# EAGLE design w5-MIDI_v03(rev4_4) (EAGLE 6.6.0)
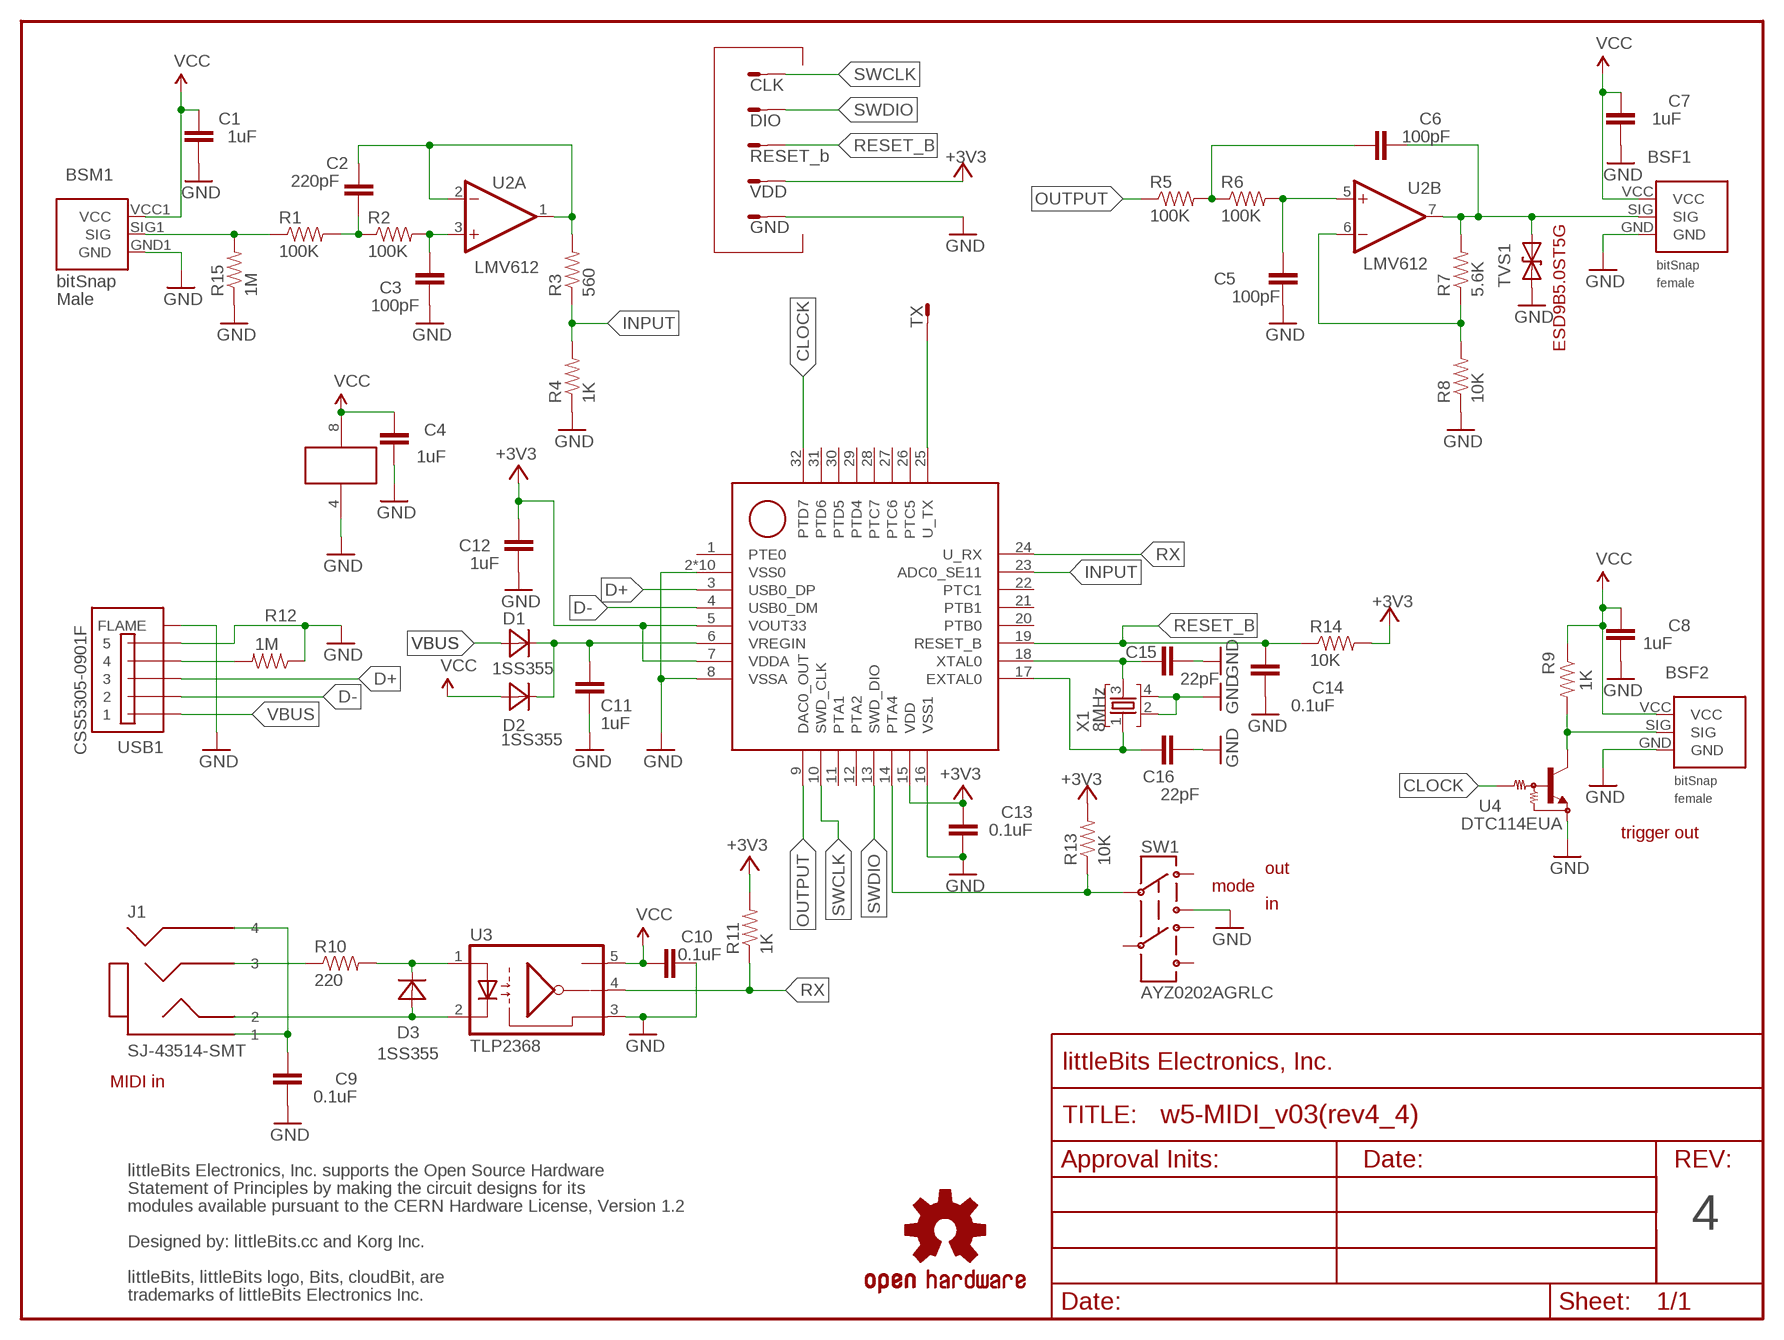
[diagram p0: schematic, sheet 1]

## Parts
BSF1  BITSNAP_V03_FEMALE  [BITSNAP_V03_FEMALE]
BSF2  BITSNAP_V03_FEMALE  [BITSNAP_V03_FEMALE]
BSM1  BITSNAP_V03_MALE  [BITSNAP_V03_MALE]
C1  1uF  CC_1608_0.8_TBR_LB_1  [CC_1608_0.8_TBR_LB_1PRIMARY]
C2  220pF  CC_1608_0.8_TBR_LB_1  [CC_1608_0.8_TBR_LB_1PRIMARY]
C3  100pF  CC_1608_0.8_TBR_LB_1  [CC_1608_0.8_TBR_LB_1PRIMARY]
C4  1uF  CC_1608_0.8_TBR_LB_1  [CC_1608_0.8_TBR_LB_1PRIMARY]
C5  100pF  CC_1608_0.8_TBR_LB_1  [CC_1608_0.8_TBR_LB_1PRIMARY]
C6  100pF  CC_1608_0.8_TBR_LB_1  [CC_1608_0.8_TBR_LB_1PRIMARY]
C7  1uF  CC_1608_0.8_TBR_LB_1  [CC_1608_0.8_TBR_LB_1PRIMARY]
C8  1uF  CC_1608_0.8_TBR_LB_1  [CC_1608_0.8_TBR_LB_1PRIMARY]
C9  0.1uF  CC_1608_0.8_TBR_LB_1  [CC_1608_0.8_TBR_LB_1PRIMARY]
C10  0.1uF  CC_1608_0.8_TBR_LB_1  [CC_1608_0.8_TBR_LB_1PRIMARY]
C11  1uF  CC_1608_0.8_TBR_LB_1  [CC_1608_0.8_TBR_LB_1PRIMARY]
C12  1uF  CC_1608_0.8_TBR_LB_1  [CC_1608_0.8_TBR_LB_1PRIMARY]
C13  0.1uF  CC_1608_0.8_TBR_LB_1  [CC_1608_0.8_TBR_LB_1PRIMARY]
C14  0.1uF  CC_1608_0.8_TBR_LB_1  [CC_1608_0.8_TBR_LB_1PRIMARY]
C15  22pF  CC_1608_0.8_TBR_LB_1  [CC_1608_0.8_TBR_LB_1PRIMARY]
C16  22pF  CC_1608_0.8_TBR_LB_1  [CC_1608_0.8_TBR_LB_1PRIMARY]
D1  1SS355  DISC_ROHM-UMD2_#_TBR_LB_1  [DISC_ROHM-UMD2_#_TBR_LB_1PRIMARY]
D2  1SS355  DISC_ROHM-UMD2_#_TBR_LB_1  [DISC_ROHM-UMD2_#_TBR_LB_1PRIMARY]
D3  1SS355  DISC_ROHM-UMD2_#_TBR_LB_1  [DISC_ROHM-UMD2_#_TBR_LB_1PRIMARY]
FRAME1  FRAME-LETTER-OHWOHW  [FABDWG01-OHW]
J1  SJ-43514-SMT  LB_K_CN_SJ-43514-SMT_LB  [LB_K_CN_SJ-43514-SMT_LB]
R1  100K  R_1608_LB  [R_1608_LB]
R2  100K  R_1608_LB  [R_1608_LB]
R3  560  R_1608_LB  [R_1608_LB]
R4  1K  R_1608_LB  [R_1608_LB]
R5  100K  R_1608_LB  [R_1608_LB]
R6  100K  R_1608_LB  [R_1608_LB]
R7  5.6K  R_1608_LB  [R_1608_LB]
R8  10K  R_1608_LB  [R_1608_LB]
R9  1K  R_1608_LB  [R_1608_LB]
R10  220  R_1608_LB  [R_1608_LB]
R11  1K  R_1608_LB  [R_1608_LB]
R12  1M  R_1608_LB  [R_1608_LB]
R13  10K  R_1608_LB  [R_1608_LB]
R14  10K  R_1608_LB  [R_1608_LB]
R15  1M  RESISTOR0402  [RES-0402]
SW1  AYZ0202AGRLC  SW_MS-22C01_#_TBR_LB_1  [SW_MS-22C01_#_TBR_LB_1PRIMARY]
TVS1  DIODE-TVSSOD-923  [SOD-923]
U1  MKL26Z64VFM4  IC_TI-QFN32_0.5_TBR_LB_1  [IC_TI-QFN32_0.5_TBR_LB_1PRIMARY]
U2  LMV612  IC_TSSOP8-DCK_0.65_TBR_LB_1  [IC_TSSOP8-DCK_0.65_TBR_LB_1PRIMARY]
U3  TLP2368  PC_PS9117-F3-A_#_TBR_LB_1  [PC_PS9117-F3-A_#_TBR_LB_1PRIMARY]
U4  DTC114EUA  DISC_SC-70_#_TBR_LB_1  [DISC_SC-70_#_TBR_LB_1PRIMARY]
U$1  OSHWCREDIT-KORG  [OSHWCREDIT-KORG]
U$5  OSHW-LOGOL  [OSHW-LOGO-L]
USB1  CSS5305-0901F  CSS5305-0109F  [MICRO-USB-FRONT-DIP-REAR-SMD]
W5JP1  GND  TEST_POINT_1  [TEST_POINT_1PRIMARY]
W5JP2  VDD  TEST_POINT_1  [TEST_POINT_1PRIMARY]
W5JP3  RESET_b  TEST_POINT_1  [TEST_POINT_1PRIMARY]
W5JP4  DIO  TEST_POINT_1  [TEST_POINT_1PRIMARY]
W5JP5  CLK  TEST_POINT_1  [TEST_POINT_1PRIMARY]
W5JP6  TX  TEST_POINT_1  [TEST_POINT_1PRIMARY]
X1  8MHz  X_ROSON_RT5_#_TBR_LB_1  [X_ROSON_RT5_#_TBR_LB_1PRIMARY]

## Nets
+3V3: C12.2 C13.2 R11.2 R13.2 R14.2 U1.5(VOUT33) U1.7(VDDA) U1.15(VDD) W5JP2.1(S)
CLOCK: U1.32(PTD7) U4.1(B)
D+: U1.3(USB0_DP) USB1.3
D-: U1.4(USB0_DM) USB1.2
GND: BSF1.GND BSF2.GND BSM1.GND1(GND) C1.2 C3.1 C4.1 C5.1 C7.1 C8.1 C9.1 C10.2 C11.2 C12.1 C13.1 C14.1 C15.1 C16.1 R4.1 R8.1 R12.1 R15.1 SW1.3 TVS1.1(A) U1.2(VSS0) U1.8(VSSA) U1.16(VSS1) U1.33(VSS0) U1.34(VSS0) U1.35(VSS0) U1.36(VSS0) U1.37(VSS0) U1.38(VSS0) U1.39(VSS0) U1.40(VSS0) U1.41(VSS0) U2.4(P:V-) U3.3(GND) U4.2(E) USB1.5 USB1.6(FLAME) USB1.7(FLAME) USB1.8(FLAME) USB1.9(FLAME) USB1.10(FLAME) USB1.11(FLAME) W5JP1.1(S) X1.2 X1.4
INPUT: R3.1 R4.2 U1.23(ADC0_SE11)
N$1: BSM1.SIG1(SIG) R1.1 R15.2
N$2: C2.2 R3.2 U2.1(A:OUT) U2.2(A:-IN)
N$3: C3.2 R2.2 U2.3(A:+IN)
N$4: C2.1 R1.2 R2.1
N$5: C9.2 J1.1 J1.4
N$6: BSF1.SIG C6.1 R7.2 TVS1.2(C) U2.7(B:OUT)
N$7: D3.1 J1.2 U3.2(C)
N$8: C11.1 D1.2 D2.2 U1.6(VREGIN)
N$9: C6.2 R5.2 R6.1
N$10: C5.2 R6.2 U2.5(B:+IN)
N$11: R13.1 SW1.2 U1.14(PTA4)
N$12: D3.2 R10.2 U3.1(A)
N$13: R12.2 USB1.4
N$15: C16.2 U1.17(EXTAL0) X1.1
N$16: C15.2 U1.18(XTAL0) X1.3
N$17: J1.3 R10.1
N$18: BSF2.SIG R9.2 U4.3(C)
N$20: R7.1 R8.2 U2.6(B:-IN)
OUTPUT: R5.1 U1.9(DAC0_OUT)
RESET_B: C14.2 R14.1 U1.19(RESET_B) W5JP3.1(S)
RX: R11.1 U1.24(U_RX) U3.4(VO)
SWCLK: U1.10(SWD_CLK) W5JP5.1(S)
SWDIO: U1.13(SWD_DIO) W5JP4.1(S)
TX: U1.25(U_TX) W5JP6.1(S)
VBUS: D1.1 USB1.1
VCC: BSF1.VCC BSF2.VCC BSM1.VCC1(VCC) C1.1 C4.2 C7.2 C8.2 C10.1 D2.1 R9.1 U2.8(P:V+) U3.5(VCC)
Unconnected: SW1.1 SW1.4 SW1.5 SW1.6 U1.1(PTE0) U1.11(PTA1) U1.12(PTA2) U1.20(PTB0) U1.21(PTB1) U1.22(PTC1) U1.26(PTC5) U1.27(PTC6) U1.28(PTC7) U1.29(PTD4) U1.30(PTD5) U1.31(PTD6)

## Notes on the sheet
- trigger out
- out
- mode
- in
- MIDI in
- 4

## Library data of the parts
BSF1 BSF2 = bitSnap:BITSNAP_V03_FEMALE
BSM1 = bitSnap:BITSNAP_V03_MALE
C1-C16 = LB_K:CC_1608_0.8_TBR_LB_1
D1-D3 = LB_K:DISC_ROHM-UMD2_#_TBR_LB_1
FRAME1 = LITTLEBITS:FRAME-LETTER-OHW
J1 = LITTLEBITS:LB_K_CN_SJ-43514-SMT_LB
R1-R14 = LB_K:R_1608_LB
R15 = LITTLEBITS:RESISTOR
SW1 = LB_K:SW_MS-22C01_#_TBR_LB_1
TVS1 = LITTLEBITS:DIODE-TVS: Bidirectional Transient Voltage Suppression Diode: Device conducts in avalanche mode after reaching a part dependent voltage threshold. Used for limiting voltage spikes on ESD sensitive inputs and outputs.; IEC_ESD_PROT0: +/-18kV; LB_PN: ?; MPN: ESD9B5.0ST5G; V_CLAMP: ?; V_OPERATION: 5V
U1 = LB_K:IC_TI-QFN32_0.5_TBR_LB_1
U2 = LB_K:IC_TSSOP8-DCK_0.65_TBR_LB_1
U3 = LB_K:PC_PS9117-F3-A_#_TBR_LB_1
U4 = LB_K:DISC_SC-70_#_TBR_LB_1
U$1 = LITTLEBITS:OSHWCREDIT-KORG
U$5 = LITTLEBITS:OSHW-LOGO: Open Source Hardware Logo This logo indicates the piece of hardware it is found on incorporates a OSHW license and/or adheres to the definition of open source hardware found here: http://freedomdefined.org/OSHW
USB1 = LITTLEBITS:CSS5305-0109F
W5JP1-W5JP6 = LB_K:TEST_POINT_1
X1 = LB_K:X_ROSON_RT5_#_TBR_LB_1

## Board
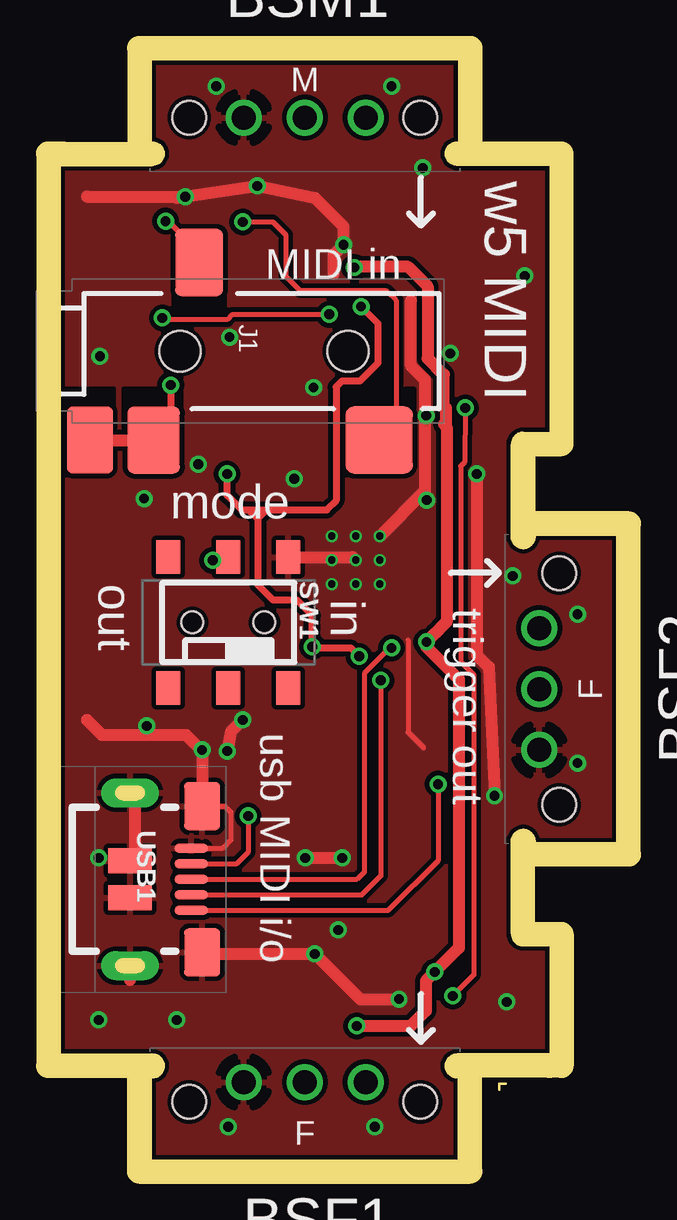
[diagram p1: board, top side]
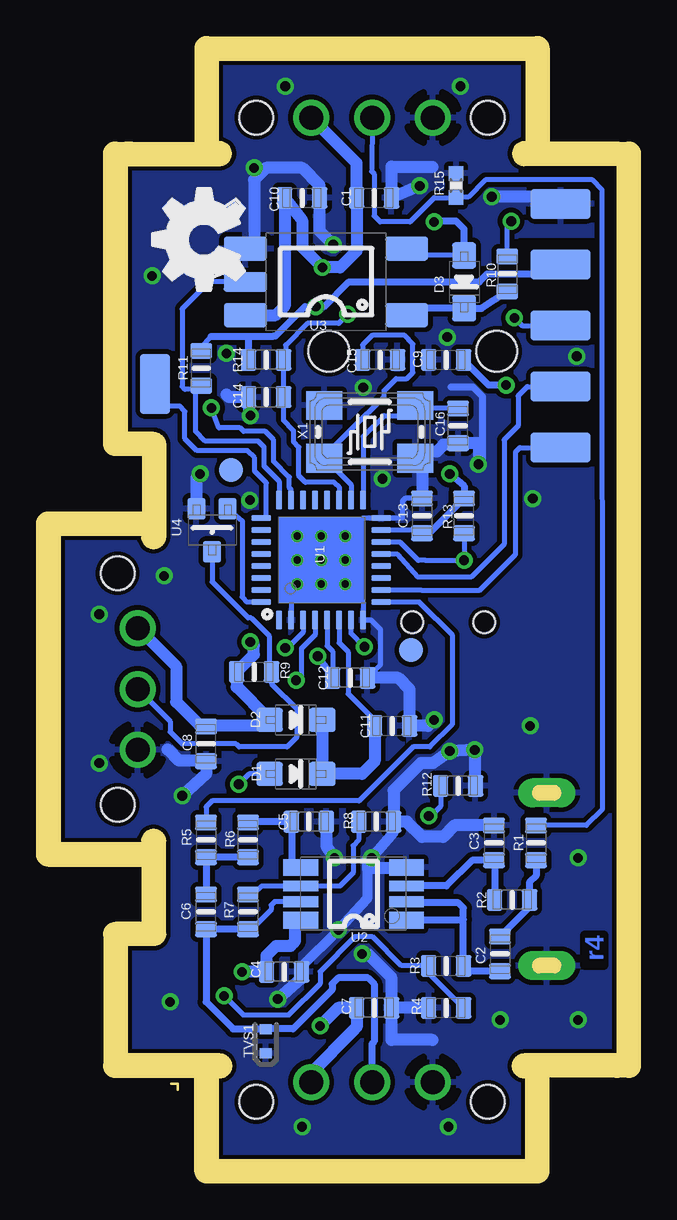
[diagram p2: board, bottom side, seen from below]

Size 23.2 x 45.81 mm. Coordinates in mm from the lower left corner, seen from the top.
Outline: 18.8,29.8 arc-90 19.3,30.3 20.4,30.3 20.4,41.41
Outline: 18.8,29.83 18.8,29.8
Outline: 3.8,0 3.8,3.4 3.85,3.4 arc180 3.85,4.4 0,4.4 0,41.41
Outline: 16.6,0 16.6,3.4 16.55,3.4 arc-180 16.55,4.4 20.4,4.4 20.4,8.9 19.3,8.9 arc-90 18.8,9.4 18.8,13.25 arc-180 19.8,13.25 19.8,13.2 23.2,13.2 23.2,26 19.8,26 19.8,25.95 arc-180 18.8,25.95 18.8,29.8
Copper layers (1*16): Top 0.035mm / dielectric 1.5mm / Bottom 0.035mm
Design rules "littleBitsDRC": minimum track width 0.2mm, minimum drill 0.2mm, track to track 0.2mm, track to pad 0.2mm, pad to pad 0.2mm, via to via 0.2mm, smd to smd 0mil, copper to edge 0.2mm, drill to drill 0.2mm, minimum pad ring 0.1mm, minimum via ring 0.15mm, stop-mask expansion 0.1mm, vias tented up to drill 0.5mm, thermal gap 0.2mm
bRestrict: 4 lines
Milling: 13 lines

### Footprints (pad centres in the part's own frame; a part is rotated, then mirrored left to right if it is on the bottom)
BITSNAP_V03_FEMALE = drill 1: GND 4.065,3.44; SIG 6.605,3.44; VCC 9.145,3.44 | hole 1.4: 1.785,2.61; 11.425,2.61
BITSNAP_V03_MALE = drill 1: GND1 9.145,2.61; SIG1 6.605,2.61; VCC1 4.065,2.61 | hole 1.4: 1.785,2.61; 11.425,2.61
CC_1608_0.8_TBR_LB_1PRIMARY = smd 0.65 x 0.9: 1 -0.725,0; 2 0.725,0
DISC_ROHM-UMD2_#_TBR_LB_1PRIMARY = smd 1.1 x 1: 1 -1.1,0; 2 1.1,0
LB_K_CN_SJ-43514-SMT_LB = smd 2.8 x 1.9: 1 -3.7,-0.75 | smd 2.8 x 2.8: 2 -3.7,-12.8 | smd 2.8 x 2: 3 3.7,-5.3 | smd 2.8 x 2.2: 4 -3.7,-3.4 | hole 1.7: 0,-4.5; 0,-11.5
R_1608_LB = smd 0.65 x 0.9: 1 -0.725,0; 2 0.725,0
RES-0402 = smd 0.6 x 0.6: 1 -0.5,0; 2 0.5,0
SW_MS-22C01_#_TBR_LB_1PRIMARY = smd 1.4 x 1: 1 2.725,2.5; 2 2.725,0; 3 2.725,-2.5; 4 -2.725,2.5; 5 -2.725,0; 6 -2.725,-2.5 | hole 0.9: 0,1.5; 0,-1.5
SOD-923 = smd 0.4 x 0.5: 1 -0.5,0; 2 0.5,0
IC_TI-QFN32_0.5_TBR_LB_1PRIMARY = smd 0.8 x 0.24: 1 -2.5,1.75; 2 -2.5,1.25; 3 -2.5,0.75; 4 -2.5,0.25; 5 -2.5,-0.25; 6 -2.5,-0.75; 7 -2.5,-1.25; 8 -2.5,-1.75; 17 2.5,-1.75; 18 2.5,-1.25; 19 2.5,-0.75; 20 2.5,-0.25; 21 2.5,0.25; 22 2.5,0.75; 23 2.5,1.25; 24 2.5,1.75 | smd 0.24 x 0.8: 9 -1.75,-2.5; 10 -1.25,-2.5; 11 -0.75,-2.5; 12 -0.25,-2.5; 13 0.25,-2.5; 14 0.75,-2.5; 15 1.25,-2.5; 16 1.75,-2.5; 25 1.75,2.5; 26 1.25,2.5; 27 0.75,2.5; 28 0.25,2.5; 29 -0.25,2.5; 30 -0.75,2.5; 31 -1.25,2.5; 32 -1.75,2.5 | drill 0.3 pad 0.5: 33 -1,1; 34 0,1; 35 1,1; 36 -1,0; 37 0,0; 38 1,0; 39 -1,-1; 40 0,-1; 41 1,-1 | smd 1 x 1: 42 -3.75,-3.75; 43 3.75,3.75
IC_TSSOP8-DCK_0.65_TBR_LB_1PRIMARY = smd 0.7 x 1.45: 1 -1.1,-2.2; 4 1.1,-2.2; 5 1.1,2.2; 8 -1.1,2.2 | smd 0.45 x 1.45: 2 -0.325,-2.2; 3 0.325,-2.2; 6 0.325,2.2; 7 -0.325,2.2
PC_PS9117-F3-A_#_TBR_LB_1PRIMARY = smd 1 x 1.8: 1 -1.39,-3.357; 2 1.39,-3.357; 3 1.39,3.358; 5 -1.39,3.358 | smd 0.8 x 1.8: 4 0,3.358
DISC_SC-70_#_TBR_LB_1PRIMARY = smd 0.75 x 0.9: 1 -0.65,-0.9; 2 0.65,-0.9; 3 0,0.9
MICRO-USB-FRONT-DIP-REAR-SMD = smd 1.4 x 0.4: 1 5.45,-1.3; 2 5.45,-0.65; 3 5.45,0; 4 5.45,0.65; 5 5.45,1.3 | drill 0.6 pad 1.2 long: 6 2.9,-3.6; 7 2.9,3.6 | smd 1.5 x 2: 8 5.9,-3.05; 9 5.9,3.05 | smd 1.8 x 1.05: 10 2.9,-0.775; 11 2.9,0.775
TEST_POINT_1PRIMARY = smd 1.25 x 2.5: 1 0,0
X_ROSON_RT5_#_TBR_LB_1PRIMARY = smd 1.5 x 1.2: 1 -1.9,-1.1; 2 1.9,-1.1; 3 1.9,1.1; 4 -1.9,1.1

### Placement (x,y rotation side)
BSF1  3.6,-0.21 0 top
BSF2  23.41,13 90 top
BSM1  16.8,46.02 180 top
C1  10.12,40.07 0 bottom
C2  4.87,8.57 270 bottom
C3  5.12,13.2 270 bottom
C4  13.87,7.82 180 bottom
C5  12.83,14.08 180 bottom
C6  17.11,10.32 90 bottom
C7  10.12,6.32 180 bottom
C8  17.11,17.32 90 bottom
C9  7.12,33.32 0 bottom
C10  13.12,40.07 0 bottom
C11  9.37,18.07 0 bottom
C12  11.12,20.07 180 bottom
C13  8.12,26.82 270 bottom
C14  14.62,31.77 0 bottom
C15  9.87,33.32 180 bottom
C16  6.62,30.57 90 bottom
D1  13.37,16.07 0 bottom
D2  13.37,18.32 0 bottom
D3  6.37,36.57 270 bottom
E$45  [OSHW_FILLX150_NOTEXT]  15.52,35.38 0 top
FRAME1  3.6,-0.21 0 top
J1  0.5,33.68 90 top
R1  3.37,13.2 270 bottom
R2  4.37,10.82 180 bottom
R3  7.12,8.07 0 bottom
R4  7.12,6.32 0 bottom
R5  17.11,13.32 270 bottom
R6  15.37,13.32 90 bottom
R7  15.37,10.32 270 bottom
R8  10.03,14.08 180 bottom
R9  15.12,20.32 0 bottom
R10  4.57,36.9 270 bottom
R11  17.32,32.97 90 bottom
R12  6.62,15.57 180 bottom
R13  6.37,26.82 90 bottom
R14  14.62,33.32 180 bottom
R15  6.7,40.59 270 bottom
SW1  7.02,22.38 90 top
TVS1  14.62,4.93 90 bottom
U1  12.32,24.98 90 bottom
U2  10.96,11.07 90 bottom
U3  12.12,36.57 90 bottom
U4  16.86,26.22 180 bottom
U$1  -73.59,-70.42 0 top  (outside the outline)
U$5  -26.88,-66.93 0 top  (outside the outline)
USB1  0.02,11.68 0 top
W5JP1  2.35,39.82 270 bottom
W5JP2  2.35,37.28 270 bottom
W5JP3  2.35,34.74 90 bottom
W5JP4  2.35,32.2 270 bottom
W5JP5  2.35,29.66 90 bottom
W5JP6  19.24,32.32 180 bottom
X1  10.29,30.32 180 bottom

### Tracks (layer width: path | path; a pad name or v marks a point on that pad's centre or on a via)
+3V3  (via drill 0.41 pad 0.6)
  Top 0.203: 7.57,27.07 7.97,27.07 7.97,26.97
  Top 0.3: 8.62,27.07 8.24,26.7 7.97,26.97 7.87,27.07 | 8.24,27.07 8.24,23.95 8.87,23.32 9.87,23.32 10.52,22.67 v10.52,21.37 10.56,21.32 12.12,21.32 v12.46,20.97 | 8.24,27.07 7.57,27.07 6.96,27.67 v6.96,28.57 | 8.24,27.07 11.12,27.07 11.5,27.45 11.5,32.2 11.74,32.44 12.5,32.44 13.25,33.19 13.25,34.84 v12.54,35.54
  Bottom 0.2: 14.21,34.32 14.3,34.32 15.12,34.32 | C12.2 11.9,20.07 | C12.2 11.84,21.17 12.07,21.4 U1.5 | C12.2 | U1.15 8.25,26.23 C13.2 | 16.9,34.3 17.36,33.84 R11.2 | v10.52,21.37 11.07,21.93 U1.7
  Bottom 0.203: 17.11,33.55 17.21,33.55 R11.2 | C12.2 11.9,20.07 | 11.9,20.07
  Bottom 0.3: W5JP2.1 3.03,37.28 3.41,36.9 5.4,36.9 5.73,36.57 11.17,36.57 12.2,35.54 v12.54,35.54 13,35.54 14.21,34.32 | v6.96,28.57 6.37,28.07 R13.2 7.81,26.09 C13.2 | 16.9,34.3 15.3,34.3 | 15.3,34.3 14.32,34.3 14.3,34.32 | R14.2 15.34,34.26 15.3,34.3 | v12.46,20.97 C12.2
CLOCK
  Bottom 0.2: U4.1 15.62,26.62 15.62,23.43 15.42,23.23 U1.32
D+  (via drill 0.41 pad 0.6)
  Top 0.2: USB1.3 12.38,11.68 12.69,11.98 12.69,20.26 13.75,21.32 v13.82,21.32
  Bottom 0.2: 13.74,21.32 v13.82,21.32 13.71,21.32 13.07,21.96 U1.3
D-  (via drill 0.41 pad 0.6)
  Top 0.2: v13.37,19.97 13.37,11.82 12.58,11.03 USB1.2
  Top 0.203: USB1.2
  Bottom 0.2: 13.24,20.09 v13.37,19.97 | 13.2,20.14 v13.37,19.97 | v13.37,19.97 13.15,20.19 13.15,21.29 12.57,21.86 U1.4
GND  (via drill 0.41 pad 0.6)
  Top 0.2: USB1.9 6.87,14.73 7.12,14.48 7.12,13.32 6.78,12.98 USB1.5 | 3.17,12.33 3.12,12.33 2.92,12.33 | 5.47,14.48 5.92,14.48
  Top 0.203: 14.5,21.65 14.5,17.8 15.15,17.15 | SW1.3 9.52,25.14 9.55,25.18
  Top 0.5: 1.12,18.32 1.74,17.7 5.24,17.7 5.92,17.02 USB1.9 | v18.11,15.16 17.86,20.52 17.36,21.02 v17.36,28.57 | v7.62,18.32 7.12,17.82 v6.96,17.02 | USB1.8 5.98,8.57 v10.62,8.57 12.52,6.67 v14.12,6.68 | 3.12,12.33 3.12,15.08 USB1.7 | v10.21,12.57 v11.77,12.57 | 1.12,40.12 v5.21,40.12 4.87,40.07 v8.21,40.57 10.62,40.07 11.82,38.87 v11.82,38.12 11.4,37.7 11.4,36.9 | SW1.3 12.2,25.11 U1.37 | U1.35 15.2,27.86 15.2,32.5 14.62,33.09 14.62,35.78 | USB1.6 2.92,7.48
  Bottom 0.2: C13.1 8.82,27.54 8.93,27.43 8.93,26.73 10.57,26.73 U1.41 | C12.1 9.84,20.62 9.84,22.09 10.23,22.48 U1.8 10.57,23.23 U1.39 | 13.57,23.73 U1.2 | C12.1 | 8.46,29.22 X1.4 | C5.1
  Bottom 0.3: C9.1 7.8,33.31 7.8,33.1 | 6.9,32.2 6,32.2 5.6,31.8 5.6,29 v5.77,28.97
  Bottom 0.406: 17.11,16.62 C8.1 17.1,16.6 | 13.14,8.02 v11.6,9.57 10.4,10.86 10.4,12.1 | 10.4,12.1 8.77,12.1 U2.4 10.23,12.17 10.4,12.1 | 10.4,12.1 10.4,12.57 v10.21,12.57 9.3,13.63 R8.1
  Bottom 0.5: v11.82,38.12 12.39,38.7 12.39,40.59 13.12,41.32 14.62,41.32 15.12,40.82 15.12,38.32 U3.3 | 18.71,17.09 18.25,16.62 17.11,16.62 17.11,16.07 v18.11,15.16 | 7.68,41.35 9.36,41.35 9.39,41.38 C1.2 v8.21,40.57 | R4.1 C7.1 | C7.1 9.39,5 9.38,4.99 7.68,4.99 | C3.1 6.77,13.92 7.24,13.44 8.12,13.44 8.75,14.08 R8.1 | R8.1 9.3,15.38 8.16,16.52 7.66,16.52 v6.96,17.02 v5.92,17.07 5.92,15.6 R12.1 | R8.1 | C11.2 7.87,18.07 v7.62,18.32 | 8.46,29.22 8.12,28.87 C13.1 | v17.36,28.57 17.52,28.42 U4.2 | C11.2 8.64,19.59 9.12,20.07 C12.1 | C11.2 | v14.12,6.68 13.14,7.54 C4.1 13.14,8.02 | v11.77,12.57 12.1,13.06 C5.1 | W5JP1.1 2.35,40.12 v5.21,40.12 | U1.33 13.57,23.73 | v10.62,8.57 10.37,8.57 9.4,7.6 9.4,6.33 C7.1 | v5.77,28.97 5.77,29.02 5.74,29.84 C16.1 6.62,29.79 7.21,29.79 7.5,29.5 8.19,29.5 X1.4 | 15.34,30.95 C14.1 16.16,31.77 16.27,31.87
  other vias: 19.36,36.82 3.62,18.07 1.62,12.57 1.62,5.82 4.87,5.82 18.61,6.57 18.86,24.32 3.51,27.54 15.27,31 16.27,33.59 15.12,41.32 6.52,44.72 13.82,44.72 7.02,1.37 13.12,1.37 21.56,22.72 21.56,16.52 10.56,32.17 1.67,33.47 7.07,34.27 9.77,28.37 15.29,27.48
  pour Top (no thermals): 10.82,26.48 10.82,23.48 13.82,23.48 13.82,26.48
  pour Top: 3.82,45.78 16.62,45.78 16.62,41.38 20.42,41.38 20.42,30.33 18.72,30.33 18.72,26.03 23.22,26.03 23.22,13.23 18.72,13.23 18.72,8.93 20.42,8.93 20.42,4.43 16.62,4.43 16.62,0.03 3.82,0.03 3.82,4.43 0.02,4.43 0.02,41.38 3.82,41.38 3.82,43.18
  pour Bottom: 3.82,45.78 16.62,45.78 16.62,41.38 20.42,41.38 20.42,30.33 18.72,30.33 18.72,26.03 23.22,26.03 23.22,13.23 18.72,13.23 18.72,8.93 20.42,8.93 20.42,4.43 16.62,4.43 16.62,0.03 3.82,0.03 3.82,4.43 0.02,4.43 0.02,41.38 3.82,41.38 3.82,43.28
INPUT  (via drill 0.41 pad 0.6)
  Top 0.2: v16.89,31.32 16.86,29.05 16.7,28.89 16.7,20.74 16.84,20.59
  Top 0.203: v16.36,6.82 17.24,7.7 17.24,20.2 16.84,20.59 16.82,20.61
  Bottom 0.2: v16.89,31.32 16.58,30.49 15.7,30.49 15.54,30.34 14.65,30.34 14.29,29.99 14.29,29.09 13.65,28.44 13.65,27.99 13.57,27.91 U1.23 | v16.36,6.82 15.57,6.03 13.66,6.03 12.37,7.32
  Bottom 0.203: 12.37,7.32 12.37,7.83 10.9,9.3 10.2,9.3 9,8.1 7.87,8.1 R3.1 7.84,7.77 R4.2
N$1
  Bottom 0.2: BSM1.SIG1 10.22,41.17 10.12,41.07 10.12,39.32 9.87,39.07 8.62,39.07 7.6,40.09 R15.2 6.68,40.1 6.2,40.1 5.48,40.82 1.02,40.82 0.62,40.4 0.62,14.57 1.27,13.92 R1.1
  Bottom 0.203: R1.1
N$2
  Bottom 0.203: C2.2 5.14,7.84
  Bottom 0.3: 5.14,7.84 6.17,7.84 R3.2 6.39,10 | U2.2 | 8.75,9.95 U2.1 8.77,10 6.39,10 | 6.39,10 6.39,10.49 6.6,10.7 8.72,10.7 U2.2
N$3
  Bottom 0.3: R2.2 5.09,12.44 C3.2 6.03,12.47 7.1,11.4 U2.3 | U2.3
N$4
  Bottom 0.203: R2.1 3.62,10.82 3.62,10.79 | R1.2 | C2.1
  Bottom 0.3: R2.1 3.64,11.54 3.37,11.82 R1.2 | 3.62,10.79 3.62,10.54 C2.1
N$5  (via drill 0.41 pad 0.6)
  Top 0.203: 3.08,29.78 3.9,29.78 J1.4
  Top 0.3: v4.62,32.27 4.62,31.32 3.08,29.78
  Top 0.5: J1.1 J1.4
  Bottom 0.3: 6.32,33.32 C9.2 5.34,32.27 v4.62,32.27
N$6
  Bottom 0.2: 14.99,9.82 15.37,9.82 R7.2 15.21,9.59 14.4,10.4 14.4,10.6 14.26,10.74 U2.7
  Bottom 0.203: BSF1.SIG 10.21,3.26
  Bottom 0.3: 10.21,3.26 10.21,4.82 10.12,4.92 10.12,7.32 10.37,7.57 11.62,7.57 11.87,7.32 11.87,7.07 13.49,5.45 14.62,5.45 | R7.2 C6.1 17.11,6.57 15.99,5.45 14.62,5.45 | 14.62,5.45 TVS1.2
N$7  (via drill 0.41 pad 0.6)
  Top 0.2: v7.62,39.07 8.87,39.07 9.4,38.53 9.4,36.8 10,36.2 13.6,36.2 14,35.8 14,30.28 J1.2
  Bottom 0.2: D3.1 8.12,37.67 8.4,37.96
  Bottom 0.203: 8.4,37.96 U3.2 | U3.2
  Bottom 0.3: D3.1 | D3.1 6.37,38.77 6.7,39.1 7.59,39.1 v7.62,39.07
N$8
  Bottom 0.2: 10.09,18.1 10.09,18.29 11.2,19.4 11.2,21.15 11.57,21.52 U1.6 | C11.1
  Bottom 0.203: C11.1 10.09,18.1 | D2.2
  Bottom 0.5: C11.1 10.09,16.59 10.62,16.07 D1.2 D2.2
N$9
  Bottom 0.3: C6.2 R5.2 R6.1 | C6.2
N$10
  Bottom 0.203: U2.5 13.37,12.17 13.37,12.18 | R6.2 15.33,14.04 15.33,14.08 | C5.2
  Bottom 0.3: R6.2 15.33,14.08 C5.2 13.55,12.36 13.37,12.18
N$11  (via drill 0.41 pad 0.6)
  Top 0.203: SW1.2 6.71,24.8 v6.37,24.97
  Bottom 0.2: 7.96,24.97 v6.37,24.97 R13.1
  Bottom 0.203: 7.96,24.97 8.27,24.97 9.03,25.73 U1.14
N$12
  Bottom 0.203: D3.2 | U3.1
  Bottom 0.3: 6.02,35.82 D3.2 | U3.1 8.47,35.47 D3.2 | D3.2 5.64,35.47 R10.2
N$13  (via drill 0.41 pad 0.6)
  Top 0.2: USB1.4 7.37,12.33 7.84,12.8 v7.84,14.32
  Bottom 0.2: R12.2 7.34,14.72 7.74,14.32 v7.84,14.32
N$15
  Bottom 0.203: C16.2 8.34,31.29 8.46,31.42 X1.1 8.88,31 9.7,31 10.57,30.13 U1.17
N$16
  Bottom 0.2: 11.04,30.45 9.7,31.79 9.7,32.04 9.2,32.54 8.75,32.54 8.5,32.79 8.5,33.99 8.85,34.34 10.2,34.34 10.59,33.95 C15.2 10.7,33.32
  Bottom 0.203: U1.18 11.07,28.12 11.97,29.02 11.97,29.22 12.27,29.22 | 11.04,30.45 12.27,29.22 | 10.7,33.31 C15.2 | X1.3 12.27,29.22
N$17  (via drill 0.41 pad 0.6)
  Top 0.2: v4.4,39.1 4.5,39.1 5.6,38 5.6,37.58 J1.3
  Bottom 0.2: R10.1 4.57,38.94 v4.4,39.1
N$18
  Bottom 0.2: U4.3 16.86,24.07 15.37,22.57 15.24,22.57 14.49,21.82 14.49,20.42 R9.2 14.39,19.84 13.35,18.79 13.35,17.59 13.74,17.2 15.74,17.2 15.87,17.32 18.11,17.32 18.61,17.82 18.61,18.25 19.99,19.63
  Bottom 0.203: 19.99,19.63 19.97,19.63 BSF2.SIG
N$20
  Bottom 0.2: R7.1 15.14,11.04 14.79,11.39 13.4,11.39 11.54,11.39 10.99,11.94 10.99,13.08 10.75,13.32 R8.2
  Bottom 0.203: U2.6 13.4,11.39 | 13.4,11.39 | R8.2 | R7.1
OUTPUT
  Bottom 0.2: U1.9 8.22,23.23 6.87,21.87 6.87,18.12 7.79,17.2 8.49,17.2 10.74,14.94 16.86,14.94 17.11,14.69 R5.1
  Bottom 0.203: R5.1
RESET_B  (via drill 0.41 pad 0.6)
  Top 0.2: v11.21,35.22 7.18,35.22 6.96,35 4.33,35 v4.27,35.07
  Bottom 0.2: U1.19 11.57,28.02 11.77,28.22 12.98,28.22 13.25,28.49 13.25,29.69 13.46,29.91 13.46,30.38 13.89,30.82 | R14.1 C14.2 | 13.8,33.41 R14.1 | v4.27,35.07 3.94,34.74 W5JP3.1 | R14.1 13.79,33.41 13.79,33.94 12.9,34.84 11.6,34.84 v11.21,35.22
  Bottom 0.203: C14.2 13.89,30.82
  Bottom 0.5: W5JP3.1 2.35,34.97
RX
  Bottom 0.2: U1.24 14.07,28.27 14.7,28.89 14.7,29.69 14.95,29.94 17.14,29.94 17.54,30.34 17.54,32.02 arc90 R11.1
  Bottom 0.203: U3.4 16.99,36.57 18.11,35.45 18.11,32.21 18,32.09 17.21,32.09 | 17.11,32.09 17.21,32.09 | 17.21,32.09 R11.1 | 14.72,36.57 U3.4 | U3.4
SWCLK
  Bottom 0.2: 8.15,23.73 5.71,23.73 4.23,25.21 4.23,29.47 4.04,29.66
  Bottom 0.203: 8.15,23.73 U1.10 | 4.04,29.66 W5JP5.1
SWDIO
  Bottom 0.203: U1.13 9.15,25.23 8.29,24.27 6.07,24.27 4.7,25.63 4.7,29.98 4.12,30.57 4.12,31.82 3.73,32.2 W5JP4.1
TX
  Bottom 0.2: 14.6,26.73 14.6,28.2 15.1,28.69 15.1,29.24 15.4,29.54 17.5,29.54 18,30.04 18,31.18 18.22,31.4
  Bottom 0.203: W5JP6.1 19.2,32.28 19.2,31.5 19.1,31.4 18.22,31.4 | 14.6,26.73 U1.25
VBUS  (via drill 0.41 pad 0.6)
  Top 0.2: USB1.1 13.68,10.38 15.76,12.46 v15.76,15.64
  Bottom 0.2: D1.1 15.32,16.07 v15.75,15.64 v15.76,15.64
VCC  (via drill 0.41 pad 0.6)
  Top 0.5: v12.37,5.57 14.62,5.57 15.24,6.2 15.24,7.45 v15.62,7.82 16.61,8.82 16.61,20.02 15.27,21.36 v15.27,21.57 15.63,21.93 16,22.29 16.11,22.4 16.11,30.53 16,30.64 16.07,30.72 16.07,31.31 16,31.39 16,32.7 15.32,33.38 15.32,36.38 14.5,37.2 12.29,37.2 v12.27,37.17
  Bottom 0.203: C8.2 17.1,18.04 17.1,18.07 | D2.1 14.52,18.32 14.52,18.38 | 10.94,5.42 10.84,5.42 10.84,5.52 | BSF1.VCC 12.76,3.23 12.76,3.26 | BSF2.VCC 19.99,22.14 19.99,22.17 | U3.5 | C10.1
  Bottom 0.5: 10.84,5.52 C7.2 11.62,6.32 v12.37,5.57 | 19.99,22.17 18.36,20.54 18.36,19.07 17.36,18.07 17.1,18.07 14.71,18.07 D2.1 14.52,18.38 15.84,19.7 R9.1 15.12,21.04 15.12,21.42 v15.27,21.57 | v15.62,7.82 C4.2 14.59,8.51 14.2,8.9 13.6,8.9 13.4,9.1 13.4,9.73 U2.8 | 14.76,35.18 U3.5 14.22,35.18 13.84,35.56 C10.1 13.12,39.14 13.12,38.02 v12.27,37.17 11.53,37.17 10.84,37.86 C1.1 10.84,41.52 BSM1.VCC1 | 10.94,5.42 12.76,3.6 12.76,3.26

### Text on the board
Bottom: r4
tPlace: w5 MIDI | MIDI in | mode | out | in | trigger out | usb MIDI i/o
tNames: BSM1 | BSF2 | BSF1
Measures: (x2) | (x2)
dxf: 4 | MIDI Module